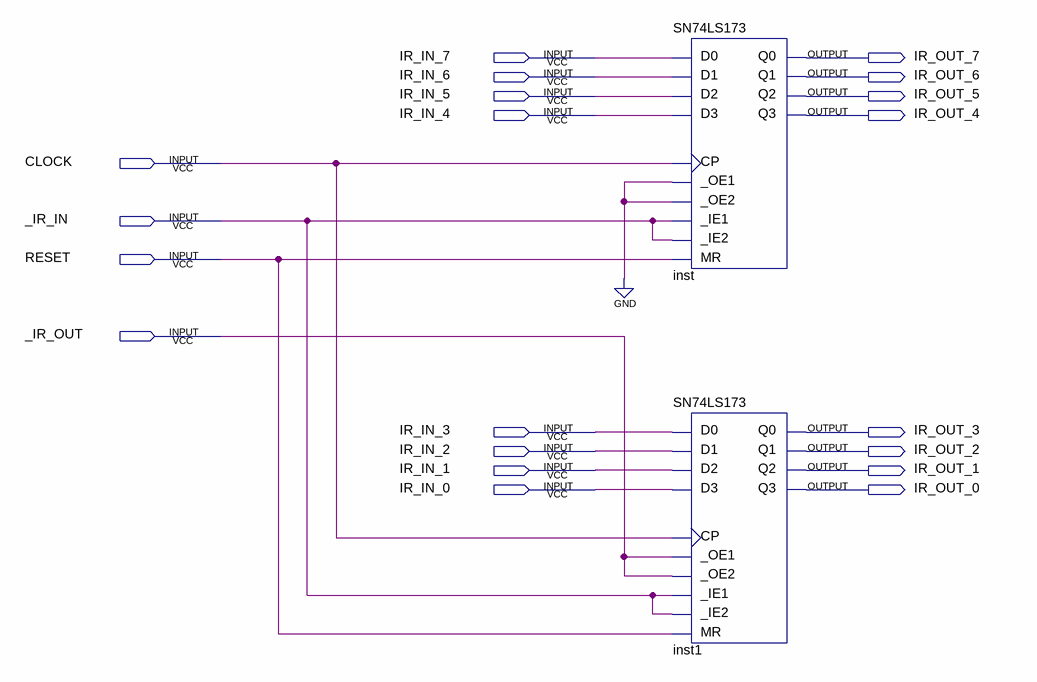
[diagram p0: schematic sheet]
// Quartus schematic IR.bdf as structural Verilog: 2 symbols, 20 pins
module IR (
  input  IR_IN_7,
  input  IR_IN_6,
  input  IR_IN_5,
  input  IR_IN_4,
  input  CLOCK,
  input  _IR_IN,
  input  RESET,
  input  _IR_OUT,
  input  IR_IN_3,
  input  IR_IN_2,
  input  IR_IN_1,
  input  IR_IN_0,
  output IR_OUT_7,
  output IR_OUT_6,
  output IR_OUT_5,
  output IR_OUT_4,
  output IR_OUT_3,
  output IR_OUT_2,
  output IR_OUT_1,
  output IR_OUT_0
);

  SN74LS173 inst (
    .D0(IR_IN_7), .D1(IR_IN_6), .D2(IR_IN_5), .D3(IR_IN_4), ._IE1(_IR_IN), ._IE2(_IR_IN), .CP(CLOCK),
    .MR(RESET), ._OE1(1'b0), ._OE2(1'b0), .Q0(IR_OUT_7), .Q1(IR_OUT_6), .Q2(IR_OUT_5), .Q3(IR_OUT_4));
  SN74LS173 inst1 (
    .D0(IR_IN_3), .D1(IR_IN_2), .D2(IR_IN_1), .D3(IR_IN_0), ._IE1(_IR_IN), ._IE2(_IR_IN), .CP(CLOCK),
    .MR(RESET), ._OE1(_IR_OUT), ._OE2(_IR_OUT), .Q0(IR_OUT_3), .Q1(IR_OUT_2), .Q2(IR_OUT_1), .Q3(IR_OUT_0));
endmodule
